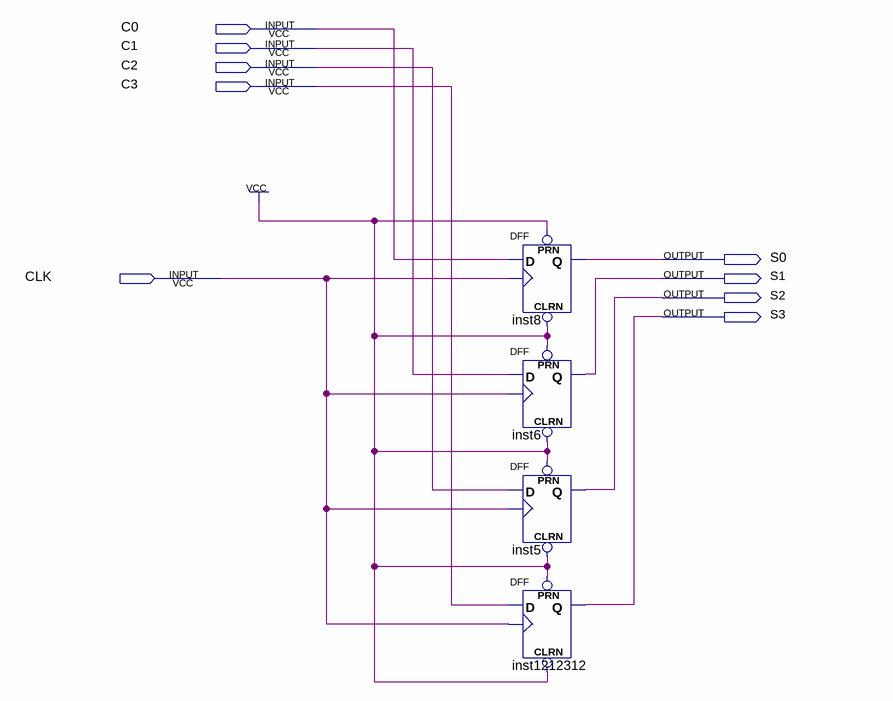
[diagram p0: schematic sheet]
// Quartus schematic deslocador_4_bits.bdf as structural Verilog: 4 symbols, 9 pins
module deslocador_4_bits (
  input  C0,
  input  C1,
  input  C2,
  input  C3,
  input  CLK,
  output S0,
  output S1,
  output S2,
  output S3
);

  DFF inst8 (.CLRN(1'b1), .CLK(CLK), .D(C0), .PRN(1'b1), .Q(S0));
  DFF inst6 (.CLRN(1'b1), .CLK(CLK), .D(C1), .PRN(1'b1), .Q(S1));
  DFF inst5 (.CLRN(1'b1), .CLK(CLK), .D(C2), .PRN(1'b1), .Q(S2));
  DFF inst1212312 (.CLRN(1'b1), .CLK(CLK), .D(C3), .PRN(1'b1), .Q(S3));
endmodule
